# EAGLE design Wifi AC Dimmer V1.1 (EAGLE 6.1)

## Sheet 1 of 2
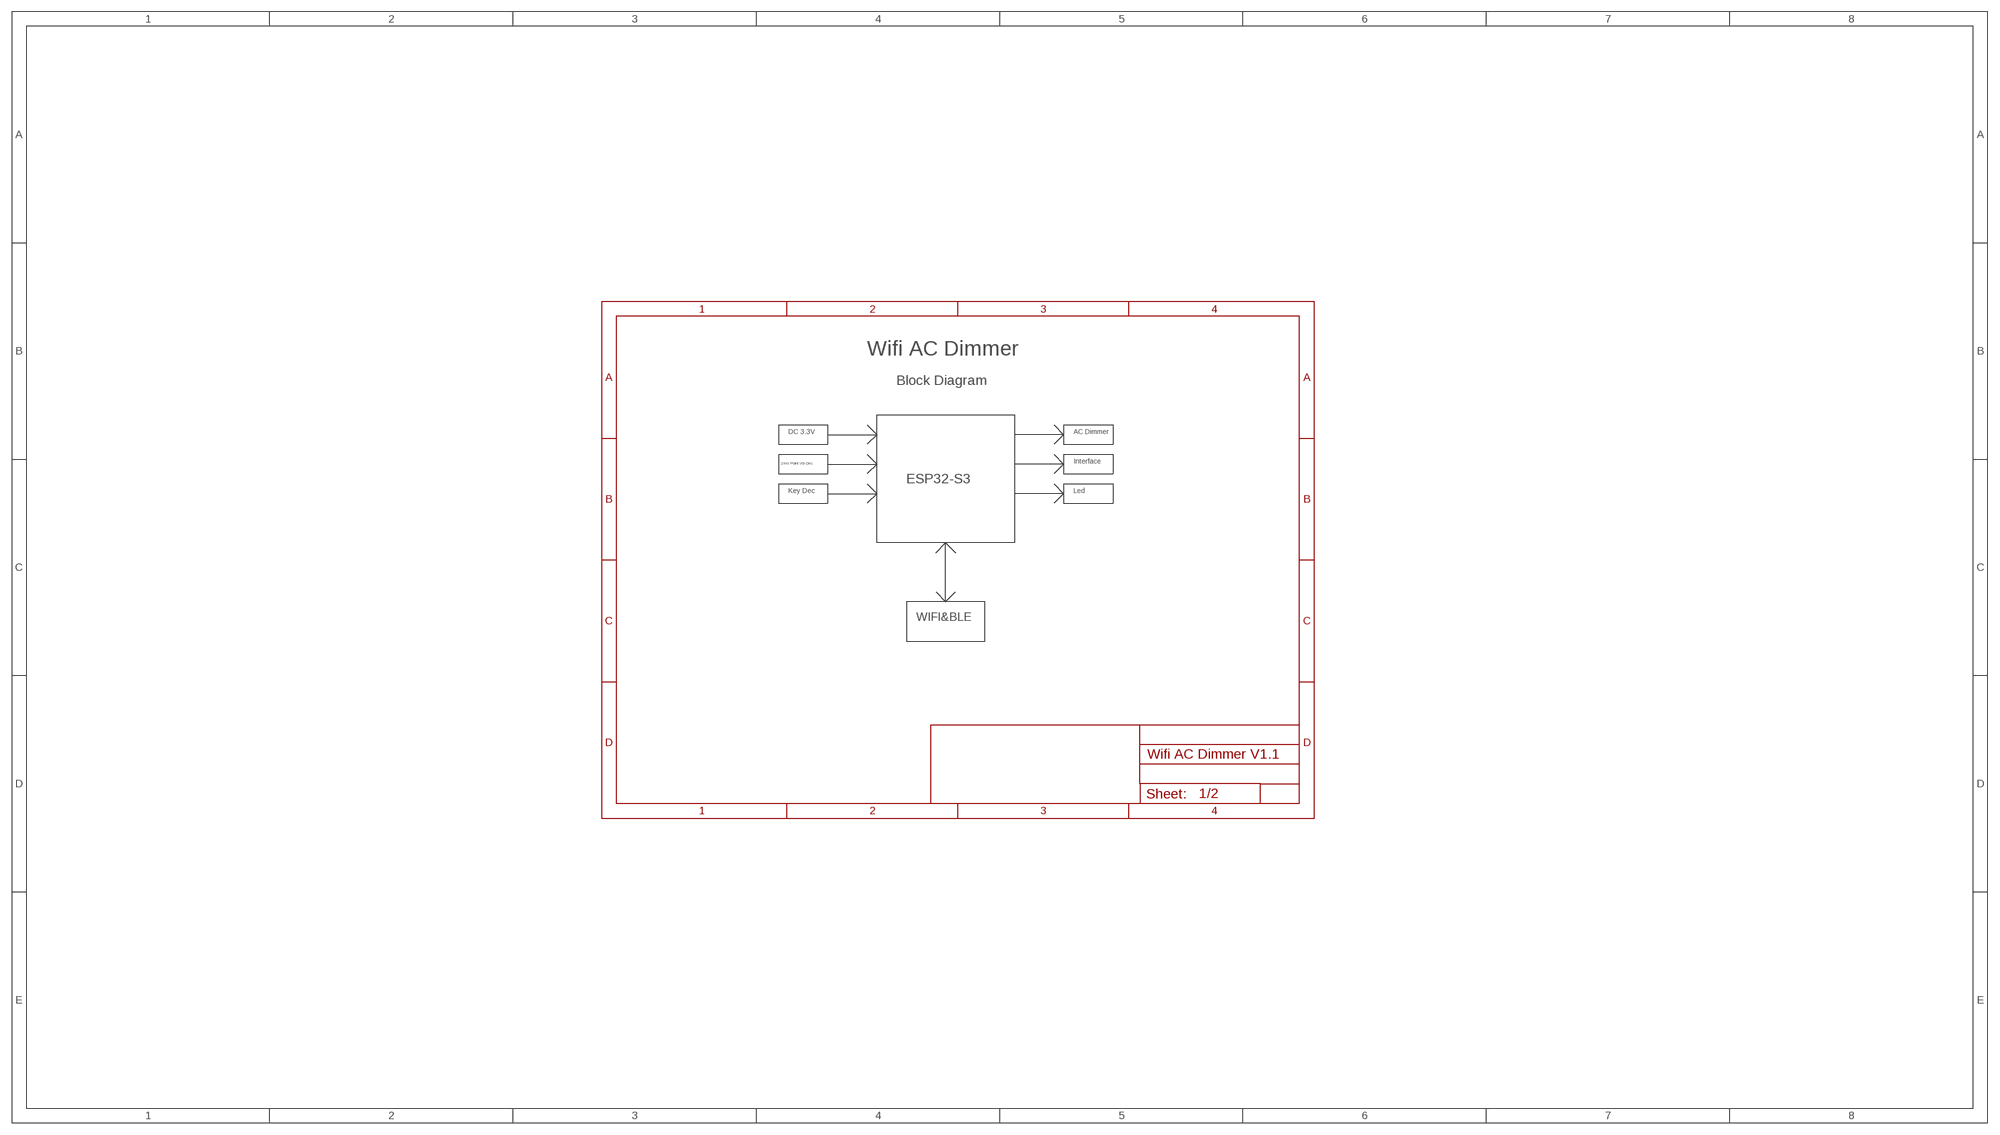
[diagram p0: schematic, sheet 1]

### Notes on the sheet
- Wifi AC Dimmer
- Block Diagram
- DC 3.3V | AC Dimmer
- Zero Point Vol Dec | Interface
- ESP32-S3
- Key Dec | Led
- WIFI&BLE

## Sheet 2 of 2
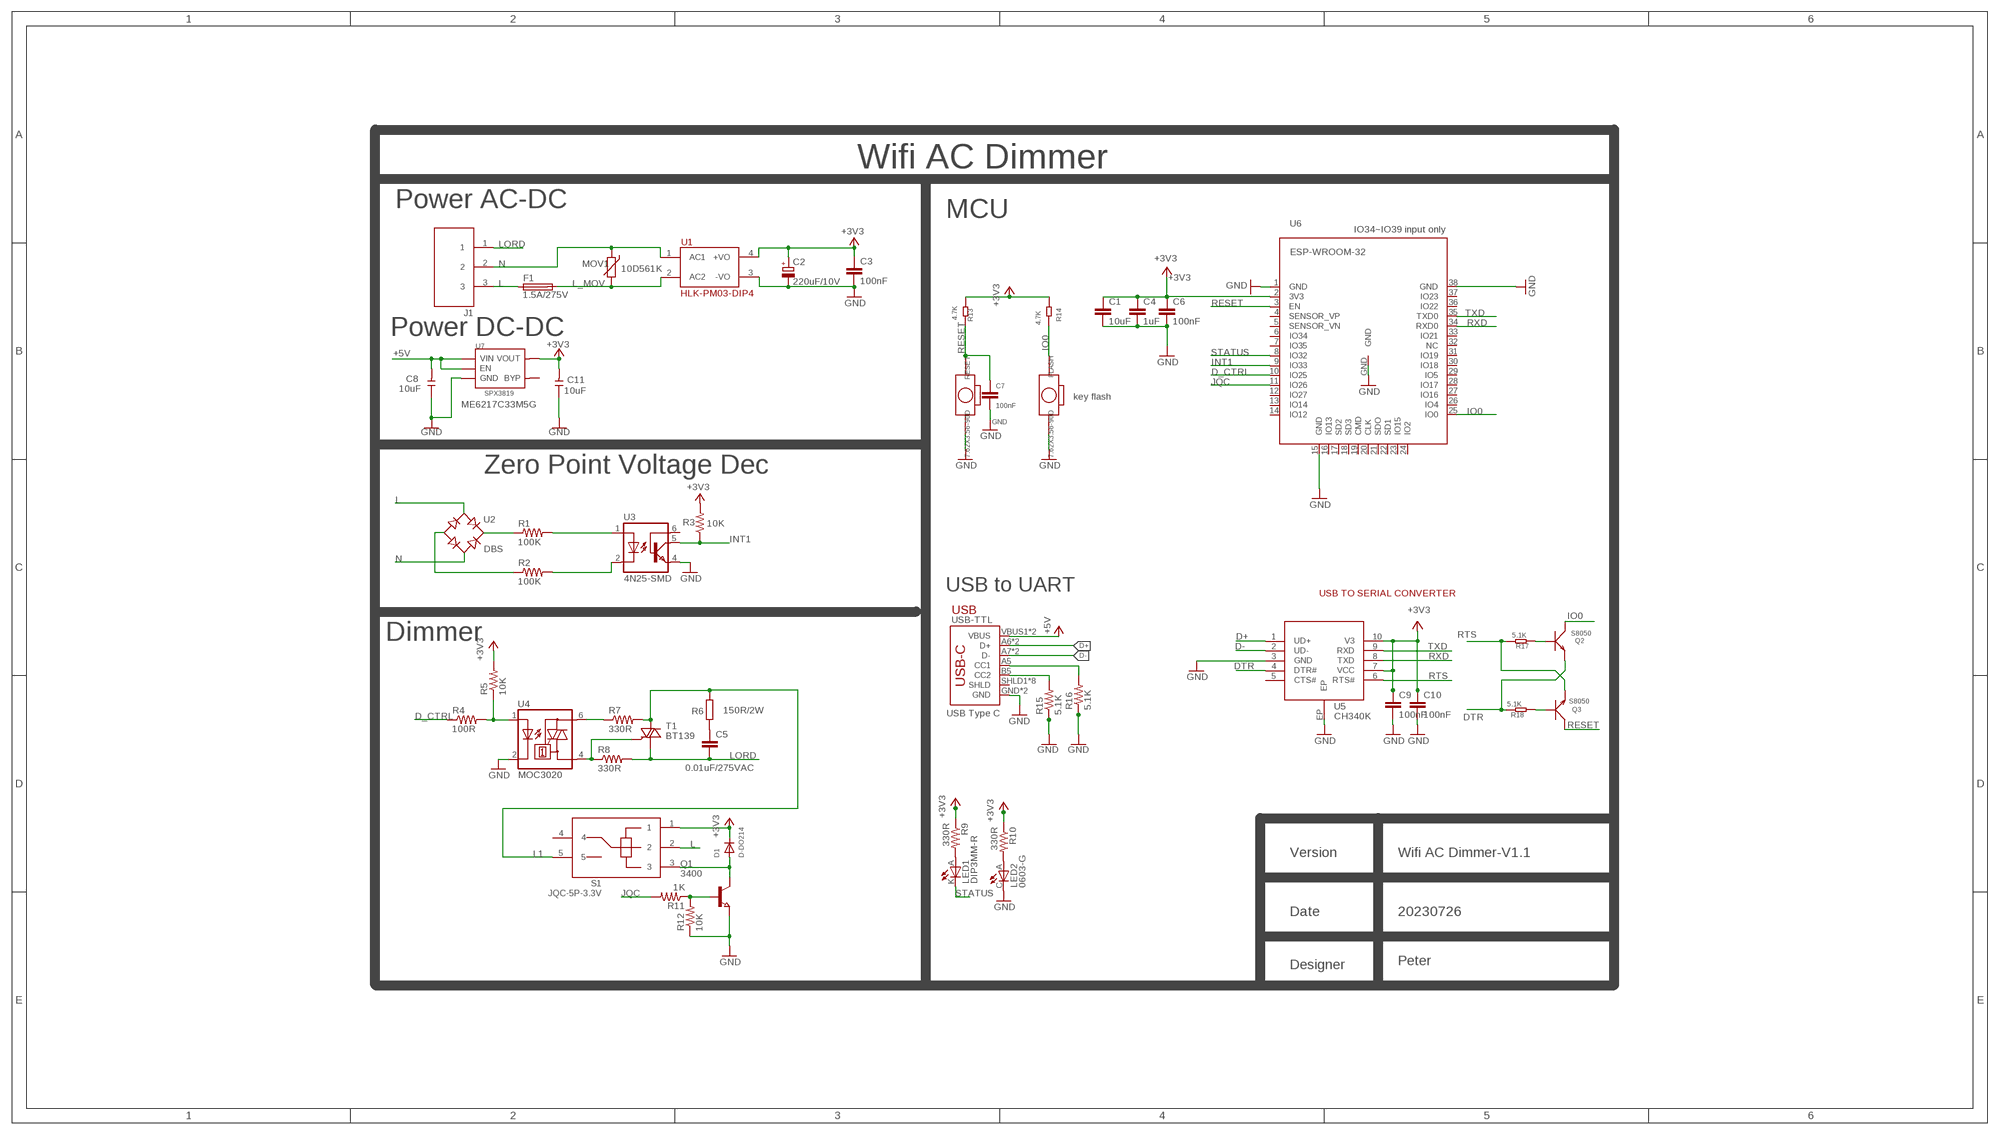
[diagram p1: schematic, sheet 2]

### Parts
C1  10uF  C0603  [C0603]
C2  220uF/10V  C-6.35  [SMD-6.3*5]
C3  100nF  C0603  [C0603]
C4  1uF  C0603  [C0603]
C5  0.01uF/275VAC  XC10B6  [XC10B6]
C6  100nF  C0603  [C0603]
C7  100nF  C0603  [C0603]
C8  10uF  C-0603  [C0603]
C9  100nF  C0603  [C0603]
C10  100nF  C0603  [C0603]
C11  10uF  C-0603  [C0603]
D1  D-DO214  [DO-214]
F1  1.5A/275V  FUSE-DIPFUSE-2P  [PICOFUSE]
FLASH  7.62X3.56-90D  KEY-2P-7.62X3.56-90D  [2P-7.62X3.56-90D]
J1  DBT50G-9.5-3P  [THROUGH-HOLE-9.5]
LED1  DIP3MM-R  LED-3MM  [LED-3MM]
LED2  0603-G  LED0603  [LED0603]
MOV1  10D561K  S10K11  [S10K11]
Q1  3400  NPN-SOT23  [SOT-23]
Q2  S8050  TRANSISTOR-NPN-SOT23  [SOT23]
Q3  S8050  TRANSISTOR-NPN-SOT23  [SOT23]
R1  100K  R0805  [R0805]
R2  100K  R0805  [R0805]
R3  10K  R0603  [R0603]
R4  100R  R0603  [R0603]
R5  10K  R0603  [R0603]
R6  150R/2W  R-0617  [R-0617]
R7  330R  R0805  [R0805]
R8  330R  R0805  [R0805]
R9  330R  R0603  [R0603]
R10  330R  R0603  [R0603]
R11  1K  R0603  [R0603]
R12  10K  R0603  [R0603]
R13  4.7K  R-0603  [R0603]
R14  4.7K  R-0603  [R0603]
R15  5.1K  R0603  [R0603]
R16  5.1K  R0603  [R0603]
R17  5.1K  R-0603  [R0603]
R18  5.1K  R-0603  [R0603]
RESET  7.62X3.56-90D  KEY-2P-7.62X3.56-90D  [2P-7.62X3.56-90D]
S1  JQC-5P-3.3V  [JQC-5P-5V]
T1  BT139  TRIAC-220-TO220  [TO220CL]
U1  HLK-PM03-DIP4  [HLK-PM03]
U2  DBS  [DB-S]
U3  4N25-SMD  [DIL6-SMD]
U4  MOC3020  MOC30  [DIL6-SMD]
U5  CH340K  [ESOP-10-EP-150MIL]
U6  ESP-WROOM-32  [ESP-WROOM-32]
U7  SPX3819  [SOT23-5]
USB-TTL  USB_C5  [USB-C-16P-5]

### Nets
+3V3: C1.1 C2.+ C3.1 C4.1 C6.1 C9.1 C10.1 C11.2 D1.C R3.2 R5.2 R9.1 R10.1 R13.2 R14.2 S1.1 U1.4(+VO) U5.7(VCC) U5.10(V3) U6.2(3V3) U7.5(VOUT)
+5V: C8.2 U7.1(VIN) U7.3(EN) USB-TTL.VBUS1(VBUS) USB-TTL.VBUS2(VBUS)
D+: U5.1(UD+) USB-TTL.A6(D+) USB-TTL.B6(D+)
D-: U5.2(UD-) USB-TTL.A7(D-) USB-TTL.B7(D-)
D_CTRL: R4.1 U6.10(IO25)
DTR: Q2.2(E) R18.1 U5.4(DTR#)
GND: C1.2 C2.- C3.2 C4.2 C6.2 C7.2 C8.1 C9.2 C10.2 C11.1 FLASH.P$2 LED2.C Q1.2(E) R12.1 R15.1 R16.1 RESET.P$2 U1.3(-VO) U3.4(EMI) U4.2(C) U5.3(GND) U5.EP U6.1(GND) U6.15(GND) U6.38(GND) U6.GND U7.2(GND) USB-TTL.GND USB-TTL.GND2(GND)
INT1: R3.1 U3.5(COL) U6.9(IO33)
IO0: FLASH.P$1 Q2.3(C) R14.1 U6.25(IO0)
JQC: R11.2 U6.11(IO26)
L: F1.1 J1.3 S1.2 U2.AC1
L1: R6.2 R7.2 S1.5 T1.A(A2)
L_MOV: F1.2 MOV1.2 U1.2(AC2)
LORD: C5.2 J1.1 R8.2 T1.C(A1)
N: J1.2 MOV1.1 U1.1(AC1) U2.AC2
N$2: Q1.1(B) R11.1 R12.2
N$3: D1.A Q1.3(C) S1.3
N$4: R1.2 U3.1(A)
N$5: R2.1 U2.-
N$6: R2.2 U3.2(C)
N$7: R7.1 U4.6(A2)
N$8: R8.1 T1.G U4.4(A1)
N$9: C5.1 R6.1
N$10: LED1.A R9.2
N$11: R4.2 R5.1 U4.1(A)
N$12: LED2.A R10.2
N$17: Q3.1(B) R18.2
N$18: Q2.1(B) R17.2
N$26: R1.1 U2.+
N$29: R16.2 USB-TTL.A5(CC1)
N$30: R15.2 USB-TTL.B5(CC2)
RESET: C7.1 Q3.3(C) R13.1 RESET.P$1 U6.3(EN)
RTS: Q3.2(E) R17.1 U5.6(RTS#)
RXD: U5.8(TXD) U6.34(RXD0)
STATUS: LED1.K(C) U6.8(IO32)
TXD: U5.9(RXD) U6.35(TXD0)
Unconnected: S1.4 U3.6(BAS) U5.5(CTS#) U6.4(SENSOR_VP) U6.5(SENSOR_VN) U6.6(IO34) U6.7(IO35) U6.12(IO27) U6.13(IO14) U6.14(IO12) U6.16(IO13) U6.17(SD2) U6.18(SD3) U6.19(CMD) U6.20(CLK) U6.21(SDO) U6.22(SD1) U6.23(IO15) U6.24(IO2) U6.26(IO4) U6.27(IO16) U6.28(IO17) U6.29(IO5) U6.30(IO18) U6.31(IO19) U6.32(NC) U6.33(IO21) U6.36(IO22) U6.37(IO23) U7.4(BYP) USB-TTL.SHLD1(SHLD) USB-TTL.SHLD2(SHLD) USB-TTL.SHLD3(SHLD) USB-TTL.SHLD4(SHLD) USB-TTL.SHLD5(SHLD) USB-TTL.SHLD6(SHLD) USB-TTL.SHLD7(SHLD) USB-TTL.SHLD8(SHLD)

### Notes on the sheet
- Wifi AC Dimmer
- Power AC-DC
- MCU
- IO34~IO39 input only
- Power DC-DC
- key flash
- ME6217C33M5G
- Zero Point Voltage Dec
- USB to UART
- USB TO SERIAL CONVERTER
- USB
- Dimmer
- USB Type C
- Version | Wifi AC Dimmer-V1.1
- Date | 20230726
- Peter
- Designer

## Library data of the parts
C1 C3 C4 C6 C7 C9 C10 = Makerfabs-Peter:C0603
C2 = Makerfabs-Peter:C-6.3*5
C5 = Makerfabs-Peter:XC10B6: 13*6 10mm
C8 C11 = Discrete:C*: Ceramic Capacitors
D1 = Makerfabs-Peter:D-DO214
F1 = Makerfabs-Peter:FUSE-DIP
FLASH RESET = Makerfabs-Peter:KEY-2P-7.62X3.56-90D
J1 = self:DBT50G-9.5-3P
LED1 = Makerfabs-Peter:LED-3MM
LED2 = Makerfabs-Peter:LED0603
MOV1 = Makerfabs-Peter:S10K11: 12.5*2*17.5 7.5
Q1 = Makerfabs-Peter:NPN-SOT23
Q2 Q3 = Discrete:TRANSISTOR-NPN*: NPN audion
R1 R2 R7 R8 = Makerfabs-Peter:R0805
R3-R5 R9-R12 R15 R16 = Makerfabs-Peter:R0603
R6 = Makerfabs-Peter:R-0617
R13 R14 R17 R18 = Discrete:R*
S1 = Makerfabs-Peter:JQC-5P-3.3V
T1 = Makerfabs-Peter:TRIAC-220
U1 = Makerfabs-Peter:HLK-PM03
U2 = Makerfabs-Peter:DBS
U3 = Makerfabs-Peter:4N25-SMD
U4 = Makerfabs-Peter:MOC30*
U5 = sale:CH340K
U6 = esp32:ESP-WROOM-32
U7 = IC:SPX3819
USB-TTL = USBC:USB_C: USB Type C 16Pin Connector Super Speed pins not available on the 16-pin purely SMD connector so this part is best for USB 2.0 implementations. D1 and D2 are tied together enabling D+/- no matter which way the cable is plugged into the connector. The two channel configuration pins (CC1/2) are exposed. These are normally connected to ground via 5.1k resistors but can be reconfigured for high current/high power applications.

## Net classes
0 default: width 0.203 mm

## Board
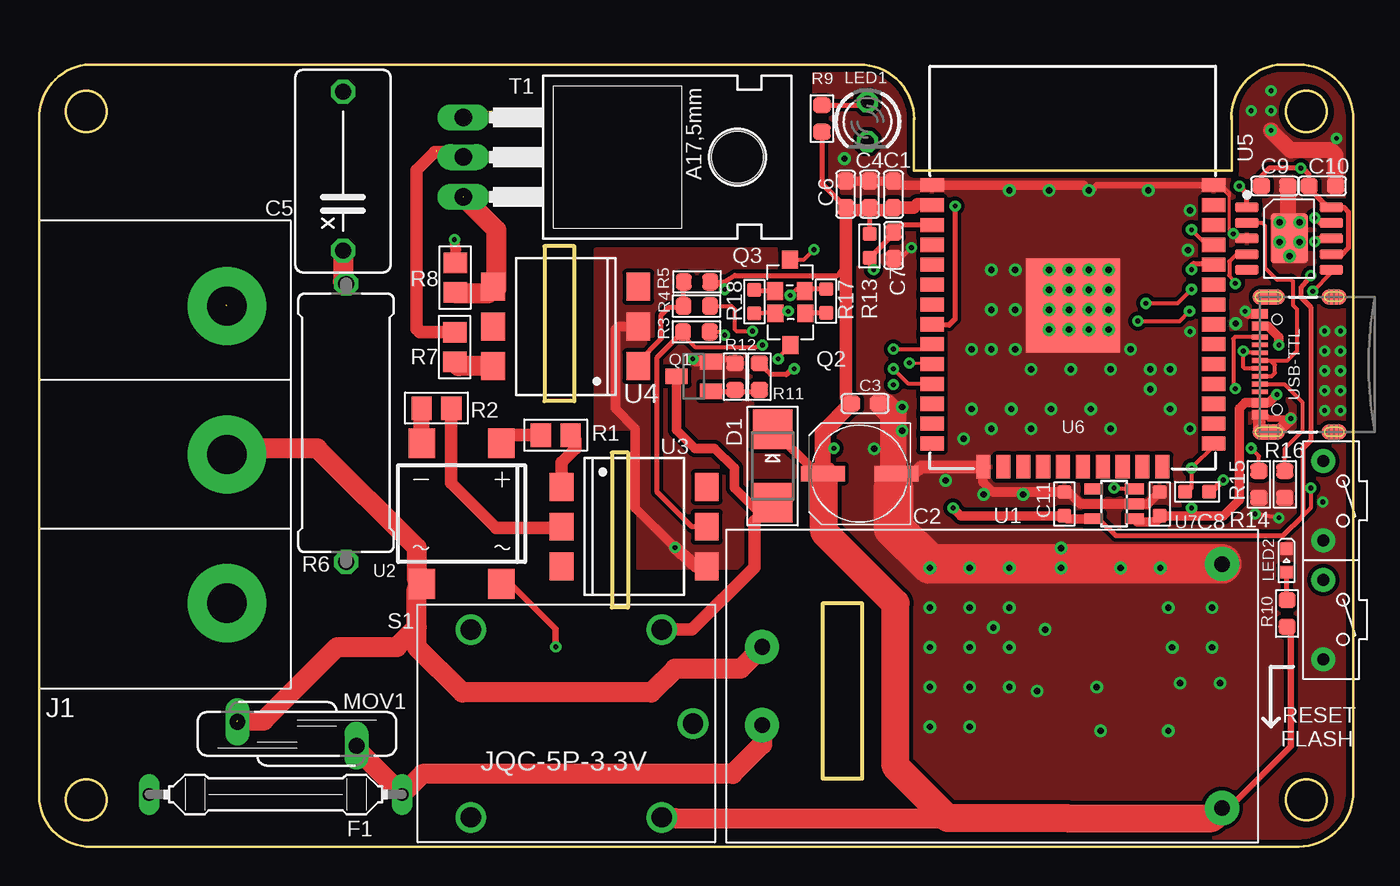
[diagram p2: board, top side]
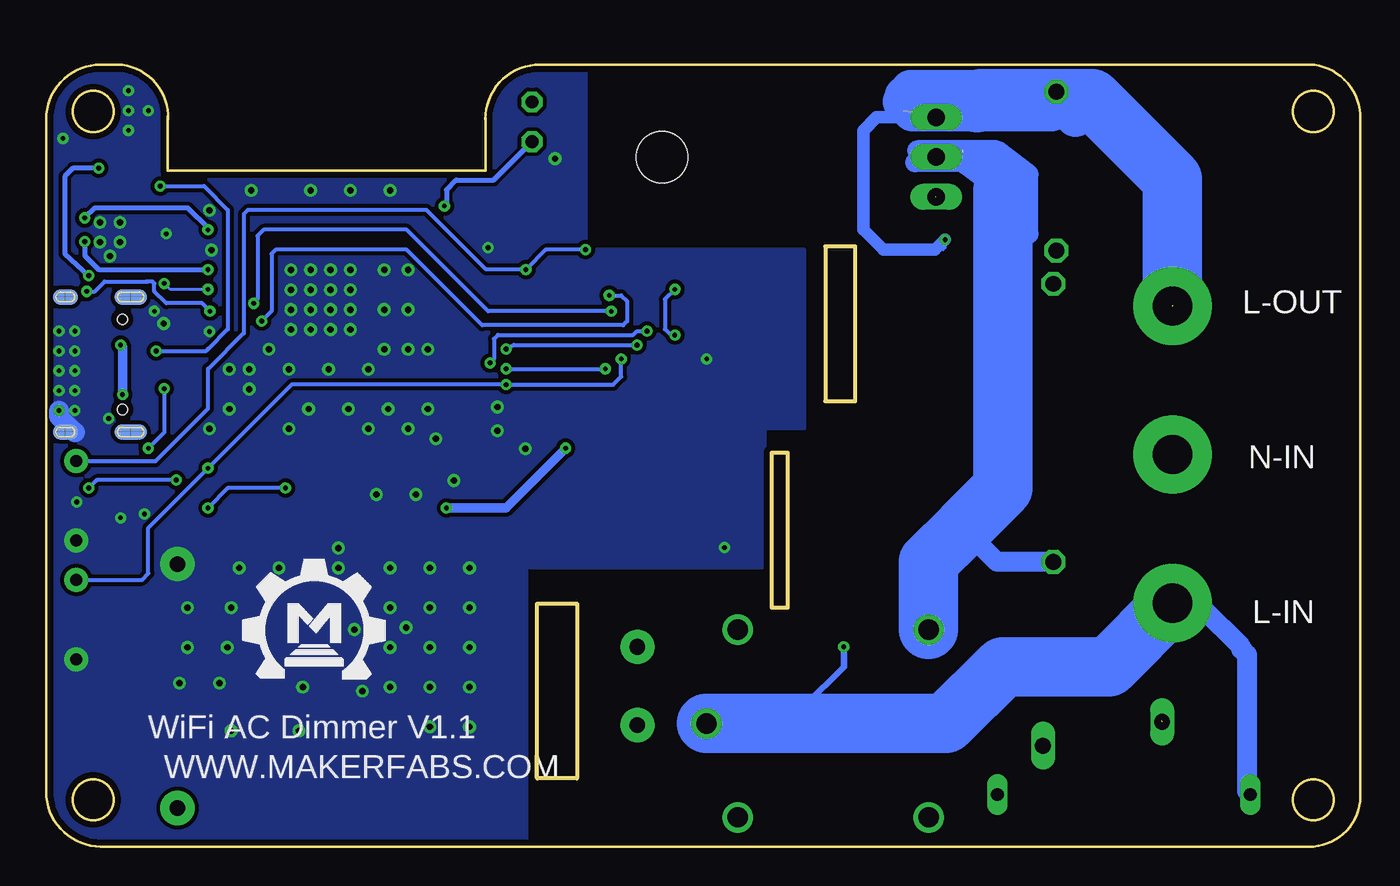
[diagram p3: board, bottom side, seen from below]

Size 84.01 x 50 mm. Coordinates in mm from the lower left corner, seen from the top.
Outline: 55.93,46.57 55.93,43.22
Outline: 55.99,43.22 76.24,43.22
Outline: 76.25,46.7 76.25,43.22
Outline: 55.94,46.5 arc90 52.44,50 3.26,50 arc90 0.01,46.5 0.01,3.5 arc90 3,0 80.51,0 arc90 84.01,3.5 84.01,46.5 arc90 80.51,50 79.46,50 arc90 76.21,46.5
Outline: 50.08,15.53 50.08,4.35 52.62,4.35 52.62,15.53 50.08,15.53
Outline: 34.21,38.39 32.3,38.39 32.3,28.48 34.21,28.48 34.21,38.39
Outline: 36.62,25.18 36.62,15.28 37.64,15.28 37.64,25.18 36.62,25.18
Outline: circle at 3.01,47 radius 1.3
Outline: circle at 3.01,3 radius 1.3
Outline: circle at 81.01,47 radius 1.3
Outline: circle at 81.01,3 radius 1.3
Copper layers (1*16): Top 0.035mm / dielectric 1.5mm / Bottom 0.035mm
Design rules: minimum track width 8mil, minimum drill 12mil, track to track 8mil, track to pad 8mil, pad to pad 8mil, via to via 8mil, smd to smd 0mil, copper to edge 15mil, drill to drill 8mil, minimum pad ring 10mil, minimum via ring 8mil, stop-mask expansion 0mil, vias tented up to drill 0mil, thermal gap 0mil

### Footprints (pad centres in the part's own frame; a part is rotated, then mirrored left to right if it is on the bottom)
C0603 = smd 1.1 x 1: 1 -0.85,0; 2 0.85,0
SMD-6.3*5 = smd 2.8 x 1: + 2.35,0; - -2.35,0
XC10B6 = drill 1.016 octagon: 1 -5.08,0; 2 5.08,0
C0603' = smd 0.889 x 0.889: 1 -0.762,0; 2 0.762,0
DO-214 = smd 2.54 x 2.54: A 2.349,0; C -2.349,0
PICOFUSE = drill 0.813 long: 1 -5.08,0; 2 11.08,0
2P-7.62X3.56-90D = drill 0.762 pad 1.524: P$1 -2.54,0; P$2 2.54,0
THROUGH-HOLE-9.5 = drill 2.5 pad 5: 1 -9.5,0; 2 0,0; 3 9.5,0
LED-3MM = drill 0.813 octagon: A -1.27,0; K 1.27,0
LED0603 = smd 0.8 x 0.8: A -0.75,0; C 0.75,0
S10K11 = drill 1.016 long: 1 -0.762,-3.81; 2 0.762,3.81
SOT-23 = smd 1 x 1.4: 1 -0.95,-1.1; 2 0.95,-1.1; 3 0,1.1
SOT23 = smd 1.016 x 1.143: 1 -0.95,-1.016; 2 0.95,-1.016; 3 0,1.016
R0805 = smd 1.3 x 1.5: 1 -0.95,0; 2 0.95,0
R0603 = smd 1 x 1.1: 1 -0.85,0; 2 0.85,0
R-0617 = drill 1.016 octagon: 1 -8.89,0; 2 8.89,0
R0603' = smd 0.889 x 0.889: 1 -0.762,0; 2 0.762,0
JQC-5P-5V = drill 1.3: 1 -6.35,5.65; 2 -8.35,-0.35; 3 -6.35,-6.35; 4 5.85,5.65; 5 5.85,-6.35
TO220CL = drill 1.118 long: A 0,-11.43; C -2.54,-11.43; G 2.54,-11.43 | hole 3.302: 0,6.096
HLK-PM03 = drill 1 pad 2.184: 1 -14.7,2.5; 2 -14.7,-2.5; 3 14.7,7.8; 4 14.7,-7.8
DB-S = smd 1.7 x 1.9: + -2.55,-4.5; - 2.55,-4.5; AC1 -2.55,4.5; AC2 2.55,4.5
DIL6-SMD = smd 1.78 x 1.52: 1 -2.54,-4.645; 2 0,-4.645; 3 2.54,-4.645; 4 2.54,4.645; 5 0,4.645; 6 -2.54,4.645
ESOP-10-EP-150MIL = smd 1.5 x 0.6: 1 -2.7,2; 2 -2.7,1; 3 -2.7,0; 4 -2.7,-1; 5 -2.7,-2; 6 2.7,-2; 7 2.7,-1; 8 2.7,0; 9 2.7,1; 10 2.7,2 | smd 2.4 x 3.2: EP 0,0
ESP-WROOM-32 = smd 0.9 x 1.5: 1 7.7,9; 2 6.43,9; 3 5.16,9; 4 3.89,9; 5 2.62,9; 6 1.35,9; 7 0.08,9; 8 -1.19,9; 9 -2.46,9; 10 -3.73,9; 11 -5,9; 12 -6.27,9; 13 -7.54,9; 14 -8.81,9; 25 -8.81,-9; 26 -7.54,-9; 27 -6.27,-9; 28 -5,-9; 29 -3.73,-9; 30 -2.46,-9; 31 -1.19,-9; 32 0.08,-9; 33 1.35,-9; 34 2.62,-9; 35 3.89,-9; 36 5.16,-9; 37 6.43,-9; 38 7.7,-9 | smd 1.5 x 0.9: 15 -10.3,5.715; 16 -10.3,4.445; 17 -10.3,3.175; 18 -10.3,1.905; 19 -10.3,0.635; 20 -10.3,-0.635; 21 -10.3,-1.905; 22 -10.3,-3.175; 23 -10.3,-4.445; 24 -10.3,-5.715 | smd 6 x 6: GND 0,0
SOT23-5 = smd 0.69 x 1.2: 1 -0.95,-1.3; 2 0,-1.3; 3 0.95,-1.3; 4 0.95,1.3; 5 -0.95,1.3
USB-C-16P-5 = smd 0.3 x 1: A5 -1.25,-0.34; A6 -0.25,-0.34; A7 0.25,-0.34; A8 1.25,-0.34; B5 1.75,-0.34; B6 0.75,-0.34; B7 -0.75,-0.34; B8 -1.75,-0.34 | smd 0.6 x 1: GND -3.225,-0.34; GND2 3.225,-0.34; VBUS1 -2.45,-0.34; VBUS2 2.45,-0.34 | smd 1 x 2.1: SHLD1 -4.32,-0.915; SHLD2 4.32,-0.915 | smd 1 x 2.1 bottom: SHLD3 -4.32,-0.915; SHLD4 4.32,-0.915 | smd 1 x 1.6: SHLD5 -4.32,-5.095; SHLD8 4.32,-5.095 | smd 1 x 1.6 bottom: SHLD6 -4.32,-5.095; SHLD7 4.32,-5.095 | hole 0.65: -2.89,-1.445; 2.89,-1.445

### Placement (x,y rotation side)
C1  54.61,41.7 90 top
C2  52.45,23.84 180 top
C3  52.79,28.33 0 top
C4  53.09,41.7 90 top
C5  19.42,43.18 90 top
C6  51.56,41.7 90 top
C7  54.62,38.44 270 top
C8  10uF  [C0603']  71.64,21.91 270 top
C9  78.98,42.23 0 top
C10  82.03,42.23 0 top
C11  10uF  [C0603']  65.54,21.91 270 top
D1  46.89,24.33 270 top
F1  12.12,3.33 0 top
FLASH  82.09,14.51 270 top
J1  12.01,25.06 270 top
LED1  52.95,46.34 270 top
LED2  79.74,18.29 90 top
MOV1  16.49,7.21 270 top
Q1  41.85,30.06 90 top
Q2  48.03,33.08 180 top
Q3  47.99,36.52 0 top
R1  33.02,26.31 0 top
R2  25.4,28.04 0 top
R3  42.01,32.91 0 top
R4  42.04,34.56 180 top
R5  42.06,36.1 0 top
R6  19.62,27.09 270 top
R7  26.56,31.93 90 top
R8  26.59,36.38 90 top
R9  50.04,46.55 90 top
R10  79.77,14.9 90 top
R11  46.04,30.05 90 top
R12  44.49,30.05 270 top
R13  4.7K  [R0603']  53.09,38.4 90 top
R14  4.7K  [R0603']  74.03,22.68 0 top
R15  77.98,23.16 90 top
R16  79.63,23.16 90 top
R17  4.7K  [R0603']  50.31,34.88 270 top
R18  4.7K  [R0603']  45.72,34.84 90 top
RESET  82.09,22.11 270 top
S1  33.45,7.52 180 top
T1  38.55,44.08 270 top
U1  60.91,10.26 0 top
U2  27.01,21.29 180 top
U3  38.04,20.45 270 top
U4  33.66,33.25 90 top
U5  79.9,38.88 0 top
U6  66.09,34.58 90 top
U7  68.71,21.91 90 top
U$6  [MAKERFABS_0.3]  70.99,10.76 0 bottom
USB-TTL  77.69,30.83 90 top

### Tracks (layer width: path | path; a pad name or v marks a point on that pad's centre or on a via)
+3V3  (via drill 0.3)
  Top 0.203: U6.2 54.92,41.01 54.62,40.7 | C6.1 51.93,40.85 52.08,40.7
  Top 0.254: R3.2 43.61,32.91 v43.82,32.7 | R5.2 43.34,36.1 v43.82,35.62 | v81.29,22.92 81.29,21.65 80.78,21.15
  Top 0.305: R13.2 C4.1 52.94,40.7 52.08,40.7 | R5.2 43.79,36.1 44.46,36.51 51.06,36.51 51.56,37.27 | R9.1 50.04,42.38 C6.1 | C9.1 78.11,42.25 78.11,42.86 78.62,43.37 v80.65,43.37 80.78,43.37 81.18,42.97 C10.1 81.29,42.13 81.29,41.97 82.39,40.88 U5.10 83.4,40.88 83.7,40.58 83.7,38.29 83.19,37.78 82.7,37.78 U5.7 | R10.1 79.36,14.05 | 67.76,20.96 68.84,19.88 79.51,19.88 80.78,21.15 80.78,25.46 81.29,25.97 81.29,34.48 80.65,35.12 80.65,35.75 v81.29,36.51
  Top 0.406: U1.4 76.07,2.46 80.02,6.41 80.02,13.81 R10.1 | U7.5 67.76,20.96 | R14.2 74.94,22.68 v75.7,23.43
  Top 0.61: C2.+ 49.73,23.84 D1.C | U7.5 65.73,20.96 C11.2 58.94,21.15 v58.43,21.65 | v50.81,25.46 50.1,25.46
  Top 0.813: S1.1 40.66,1.81 | C1.1 55.91,40.85 56.14,41.09 57.01,41.09 U6.2 | 54.62,40.7 52.08,40.7 51.71,40.7 C6.1 51.56,37.27 51.56,28.71 C3.1
  Top 1.016: C2.+ 50.1,25.46 50.1,26.49 C3.1
  Top 1.27: 40.66,1.81 65.7,1.81
  Top 1.778: U1.4 74.96,1.81 65.7,1.81 58.07,1.81 54.74,5.14 54.74,15.56 50.17,20.13 50.17,23.77 C2.+
  Bottom 0.254: v43.82,32.7 44.08,32.7 44.46,33.08 44.46,34.99 v43.82,35.62 | v75.7,23.43 80.78,23.43 v81.29,22.92
  Bottom 0.305: v80.65,43.37 82.3,43.37 82.81,42.86 82.81,37.91 v81.29,36.51
  Bottom 0.61: v58.43,21.65 54.62,21.65 v50.81,25.46
+5V  (via drill 0.3)
  Top 0.254: U7.3 68.78,22.86 v68.71,22.92 | v73.67,21.65 74.18,21.15
  Top 0.305: 70.2,21.15 U7.1
  Top 0.61: U7.1 70.21,20.77 71.38,20.77 71.64,21.02 C8.2 74.18,21.15 75.7,21.15 76.72,22.16 76.72,28 77.1,28.39 78.02,28.39 USB-TTL.VBUS1 78.61,28.38 v79.13,28.89 | USB-TTL.VBUS2 78.56,33.28 79.26,32.58 v79.26,32.07
  Bottom 0.254: v68.71,22.92 72.4,22.92 v73.67,21.65
  Bottom 0.61: v79.13,28.89 79.13,31.94 v79.26,32.07
D+  (via drill 0.3)
  Top 0.254: USB-TTL.B6 77.08,31.58 v76.97,31.69 76.97,30.67 77.06,30.58 USB-TTL.A6
  Top 0.305: U5.1 77.2,41.74 v76.72,42.23
  Bottom 0.254: v76.72,42.23 73.92,42.23 72.4,40.7 72.4,33.08 73.67,31.81 73.79,31.69 v76.97,31.69
D-
  Top 0.254: U5.2 78.18,39.88 78.37,39.69 78.37,37.02 79.13,36.26 80.02,36.26 80.14,36.13 80.14,34.61 80.4,34.35 80.4,31.69 79.76,31.05 78.75,31.05 | 78.75,31.05 78.06,31.05 USB-TTL.A7 | USB-TTL.B7 78.79,30.08 79,30.29 79,30.8 78.75,31.05
D_CTRL  (via drill 0.3)
  Top 0.203: v55.63,30.93 56.78,30.93 57.09,30.62 | U6.10 57.09,30.62 | 57.09,30.62 57.16,30.54
  Top 0.254: R4.1 44.25,34.56 44.46,34.35 44.46,33.08 44.58,32.96 v45.6,32.96
  Bottom 0.254: 45.85,32.96 v45.6,32.96 46.24,32.96 46.49,32.7 55.13,32.7 55.38,32.45 55.38,31.18 v55.63,30.93
DTR  (via drill 0.3)
  Top 0.254: U5.4 76.55,37.88 76.08,37.4 76.08,36.51 v76.46,36.01 | Q2.2 47.75,34.09 v47.89,34.23 | v70.75,34.73 72.78,34.73 v73.67,35.62
  Top 0.305: R18.1 47.07,34.21 Q2.2
  Bottom 0.203: v73.67,35.62 76.08,35.62 v76.46,36.01
  Bottom 0.254: v47.89,34.23 55.76,34.23 60.97,39.43 70.11,39.43 70.49,39.05 70.49,34.99 v70.75,34.73
GND  (via drill 0.3, 0.41)
  Top 0.203: v80.02,27.37 77.99,27.37 | 76.08,41.59 76.08,41.85 75.65,42.28 U6.38 75.09,42.12 75.06,42.1 | v76.33,39.18 76.08,39.43 76.08,41.59 | 76.08,41.59 75.32,42.35 75.19,42.35 75.06,42.23 75.06,42.1 | 75.06,42.1 74.94,41.97
  Top 0.254: R12.1 44.48,30.9 44.46,30.93 | U5.3 76.64,38.88 v76.33,39.18 | v67.1,41.95 67.29,41.95 67.32,41.97 | C7.2 55.06,37.59 v55.76,38.29 | R16.1 79.4,22.31 | v79.26,21.02 v77.73,21.27
  Top 0.406: v41.79,31.18 44.2,31.18 44.46,30.93 | U6.38 67.62,42.28 67.32,41.97 | USB-TTL.GND 78.39,27.6 78.62,27.37 v80.02,27.37
  Top 0.61: U4.2 37.01,33.25 36.84,33.08 36.84,28 38.11,26.73 38.11,21.65 v40.65,19.11 41.92,17.84 | U6.15 60.33,24.24 60.33,23.3 60.97,22.67 C11.1 65.79,22.67 66.56,21.91 U7.2 70.87,21.91 C8.1 | Q1.2 41.96,31.01 v41.79,31.18 | C6.2 C4.2 C1.2 54.88,42.28 U6.1 66.77,42.28 v67.1,41.95 | USB-TTL.GND2 77.27,34.05 77.22,34.1
  Top 0.813: U3.4 41.98,17.91 v40.65,19.11 | U6.15 56.35,24.28 55.89,23.81 54.83,23.81 C2.- | v80.02,27.37 79.13,26.48 78.24,26.48 77.99,26.73 77.99,27.37
  Top 1.016: C9.2 79.83,39.62 80.02,39.43 | C10.2 82.88,44.19 82.56,44.51 80.02,44.51 v78.75,45.78
  Top 1.676: 54.62,22.92 54.62,27.62 54.11,28.13
  Top 2.54: U1.3 56.94,18.06 54.62,20.38 54.62,22.92
  Bottom 1.27: v83.19,27.88 83.19,27.5 82.18,26.48
  other vias: 72.94,10.45 74.98,15.28 72.18,7.4 75.48,10.45 67.61,10.2 67.86,7.4 71.67,17.82 62.02,17.82 64.31,13.88 61.01,14.01 63.8,9.94 64.56,36.87 65.83,36.87 67.1,36.87 68.37,36.87 68.37,35.6 68.37,34.33 68.37,33.06 67.1,33.06 65.83,33.06 64.56,33.06 64.56,34.33 64.56,35.6 65.83,35.6 67.1,35.6 67.1,34.33 65.83,34.33 79.29,39.91 80.56,39.91 80.56,38.64 79.29,38.64 79.93,37.76 70.91,41.95 73.45,38.14 73.58,40.68 73.58,32.93 60.88,36.87 60.88,34.33 60.88,31.79 63.42,30.52 65.96,30.52 68.5,30.52 71.04,30.52 72.31,27.98 67.23,27.98 64.69,27.98 62.15,27.98 59.61,27.98 60.88,26.71 63.42,26.71 59.1,26.07 68.5,26.71 77.1,34.23 82.18,32.96 82.18,30.42 82.18,27.88 82.18,31.69 82.18,29.15 83.19,29.15 83.19,30.42 83.19,31.69 83.19,32.96 82.05,22.04 76.5,33.44 56.94,17.82 56.94,15.28 56.94,12.74 56.94,10.2 56.94,7.66 59.48,7.66 59.48,10.2 59.48,12.74 59.48,15.28 59.48,17.82 62.02,15.28 62.02,12.74 62.02,10.2 72.18,15.28 74.98,12.74 65.32,17.82 65.32,19.09 62.91,22.52 60.37,22.52 57.96,23.4 55.16,26.58 55.16,28.1 53.39,25.44 62.4,31.79 62.4,34.33 62.4,36.87 64.56,41.95 62.02,41.95 78.75,47.05 77.48,47.05 78.75,48.32 51.48,43.98 82.94,45.28 69.77,31.79 71.04,29.25 73.58,26.71 72.31,30.52 59.61,31.79 69.13,17.82 72.44,12.74
  pour Top (isolate 0.254, rank 6): 49.54,55.94 49.54,38.16 35.57,38.16 35.57,28 35.57,26.73 38.11,26.73 38.11,17.84 53.35,17.84 53.35,-2.48 87.64,-2.48 88.91,-2.48 88.91,55.94
  pour Bottom (isolate 0.254, rank 6): 49.54,55.94 49.54,38.16 35.57,38.16 35.57,26.73 38.11,26.73 38.11,17.84 53.35,17.84 53.35,-2.48 91.45,-2.48 92.72,-2.48 92.72,59.75 49.54,59.75
INT1  (via drill 0.3)
  Top 0.254: R3.1 41.16,32.7 41.92,31.94 45.85,31.94 v46.24,32.07 | v54.62,31.81 57.16,31.81 57.16,32.05 U6.9
  Top 0.305: U3.5 41.73,20.45 39.5,22.67 39.5,31.26 R3.1
  Bottom 0.254: v54.62,31.81 54.11,32.07 v46.24,32.07
IO0  (via drill 0.3)
  Top 0.254: U6.25 75.09,25.61 v73.67,24.19 73.67,22.92 73.42,22.68 R14.1 | v47.25,31.18 47.25,31.28 Q2.3
  Bottom 0.254: FLASH.P$1 77.89,17.05 77.48,17.46 77.48,20.38 v73.67,24.19 68.33,29.53 v54.62,29.53 47.76,29.53 47.25,30.04 v47.25,31.18
JQC  (via drill 0.3)
  Top 0.254: U6.11 55.58,29.58 v54.62,30.54 | 46.4,30.54 R11.2
  Top 0.305: v48.27,30.54 48.14,30.54 47.76,30.16 46.78,30.16 46.4,30.54
  Bottom 0.254: v54.62,30.54 v48.27,30.54
L  (via drill 0.3)
  Top 0.406: U2.AC1 30.14,16.79 33.03,13.91 v33.03,12.76
  Bottom 0.203: 35.57,8.95 40.71,8.95 S1.2
  Bottom 0.406: v33.03,12.76 33.03,11.49 35.57,8.95
  Bottom 1.27: 16.08,11.49 15.25,11.49 11.44,15.3 10.17,15.3 7.63,12.76 7.63,12.64 7.25,12.26 7.25,3.54 F1.1
  Bottom 3.81: S1.2 26.49,7.87 22.87,11.49 16.08,11.49 J1.3
L1  (1 unrouted)
  Top 0.203: 25.28,44.39 25.41,44.51 26.68,44.51 26.68,43.75
  Top 0.813: R7.2 24.34,32.88 24.14,33.08 24.14,43.24 25.28,44.39 26.81,44.39 T1.A
  Bottom 0.203: 24.65,43.75 24.65,44.01 24.26,44.39 | 24.39,44.39 24.26,44.39 | 24.26,44.39 24.14,44.51 | 25.28,43.62 25.41,43.75 25.41,44.39
  Bottom 1.27: R6.2 23.22,18.2 25.41,20.38 | 22.87,41.97 22.87,43.24 24.39,44.39 25.41,44.39 28.2,44.39 | 24.65,43.75 25.41,43.75 28.46,43.75 | 23.76,42.48 25.28,43.62 | 28.33,44.51 24.14,44.51 23.25,44.51 21.22,42.99 21.22,39.18
  Bottom 3.81: 22.81,40.78 22.87,41.97 22.87,22.92 25.41,20.38 27.6,18.19 S1.5
L_MOV
  Top 1.27: MOV1.2 20.3,6.24 F1.2 24.51,4.64 44.33,4.64 46.21,6.52 U1.2 46.21,8.21
LORD  (via drill 0.3)  (2 unrouted)
  Top 0.61: R8.2 26.59,38.76 v26.55,38.8 26.55,38.29 26.68,38.16
  Bottom 0.203: 21.6,47.82 21.15,48.26 C5.2 19.74,48.26 19.87,48.4 | 17.79,47.82 17.79,47.05 | v26.55,38.8 26.55,38.29 26.68,38.16 | 28.77,48.4 29.15,48.4 29.22,48.32 29.16,48.26 29.16,48.02 29.16,47.7 29.22,47.63 29.22,47.05 | 28.65,47 28.33,47 27.95,46.62
  Bottom 0.813: T1.C 27.95,46.62 30.92,46.62 31.76,45.78 31.76,39.43 30.49,38.16 27.19,38.16 v26.55,38.8
  Bottom 2.54: 18.22,46.62 17.79,47.05 | 28.77,48.4 19.87,48.4 | 29.16,48.02 20.26,48.02 | 29.28,47.63 29.22,47.63 20.38,47.63 | 28.65,47 19.75,47
  Bottom 3.81: 24.52,47.56 24.26,47.82 21.6,47.82 17.79,47.82 17.15,47.82 12.01,42.67 12.01,34.67 11.95,34.61
N  (1 unrouted)
  Top 0.203: 12.41,25.46 J1.2
  Top 1.27: U1.1 46.21,12.74 44.84,11.37 40.65,11.37 39.12,9.84 27.06,9.84 24.14,12.76 24.14,14.03 | 24.14,14.03 24.14,16.47 U2.AC2 24.14,17.11 24.14,19.11 17.79,25.46 12.41,25.46 | 12.71,8.06 14.36,8.06 19.06,12.76 22.87,12.76 24.14,14.03
N$2
  Top 0.305: Q1.1 44.46,29.11 | 44.46,29.11 45.95,29.11 R11.1 | R12.2 44.49,29.14 44.46,29.11
N$3
  Top 0.203: D1.A 46.89,21.76 | 46.89,21.76 47,21.65 | 46.89,21.76 45.73,22.92
  Top 0.61: 46.15,21.23 44.46,22.92 44.46,24.19 43.19,25.46 41.92,25.46 40.75,26.63 Q1.3
  Top 0.813: S1.3 41.75,13.87 45.73,17.84 45.73,20.82 46.15,21.23 D1.A
N$4
  Top 0.813: U3.1 33.39,24.56 34.3,25.46 34.3,25.98 R1.2
N$5
  Top 1.016: U2.- R2.1
N$6
  Top 0.813: R2.2 26.35,23.25 29.22,20.38 33.33,20.38 U3.2
N$7
  Top 1.27: U4.6 26.83,30.71 R7.1
N$8  (1 unrouted)
  Top 0.203: R8.1 28.65,35.43 U4.4
  Top 1.27: T1.G 29.22,39.43 29.22,35.62 28.96,35.62 28.71,35.37 26.65,35.37 R8.1
N$9
  Top 0.203: R6.1 19.59,35.98 19.57,36.01
  Top 1.27: C5.1 19.42,36.15 19.57,36.01
N$10
  Top 0.305: R9.2 52.55,47.4 52.84,47.69 52.92,47.61 LED1.A
N$11
  Top 0.305: U4.1 38.3,30.99 39.76,32.45 39.76,33.97 40.27,34.48 41.1,34.48 R4.2 41.19,36.08 R5.1
N$12
  Top 0.305: R10.2 79.77,17.45 79.76,17.46 79.76,17.52 LED2.A
N$17
  Top 0.305: Q3.1 45.95,35.5 R18.2
N$18
  Top 0.305: R17.2 49.08,34.12 Q2.1
N$26
  Top 0.813: R1.1 30.07,26.31 U2.+
N$29
  Top 0.254: USB-TTL.A5 78.08,29.53 79.64,29.53 80.78,28.39 80.78,26.61 79.63,25.46 R16.2
N$30  (via drill 0.3)
  Top 0.254: USB-TTL.B5 76.46,32.58 76.33,32.45 76.33,29.4 v76.46,29.27 | R15.2 77.98,24.96 v77.48,25.46
  Bottom 0.254: v77.48,25.46 77.1,25.84 76.59,26.35 76.46,26.48 v76.46,29.27
RESET  (via drill 0.3)
  Top 0.254: Q3.3 48.91,37.53 v49.54,38.16 | R13.1 53.09,37.15 v53.35,36.89
  Top 0.305: R13.1 54.62,39.17 C7.1 55.08,39.74 U6.3
  Bottom 0.254: v49.54,38.16 52.08,38.16 v53.35,36.89 55.89,36.89 59.7,40.7 71.13,40.7 71.38,40.45 71.38,32.83 73.67,30.54 73.67,28 77.02,24.65 RESET.P$1
RTS  (via drill 0.3)
  Top 0.254: U5.6 82.6,36.69 v81.41,35.5 | R17.1 48.41,35.64 v48.01,35.24 | v70.24,33.59 72.91,33.59 v73.54,34.23
  Top 0.305: R17.1 49.08,35.64 Q3.2
  Bottom 0.254: v48.01,35.24 47.25,35.24 46.87,34.86 46.87,33.59 47.12,33.34 56.14,33.34 60.97,38.16 69.35,38.16 69.6,37.91 69.6,34.23 v70.24,33.59 | v81.41,35.5 80.91,35.5 80.27,36.13 77.6,36.13 77.48,36.13 77.22,36.13 77.1,36.01 77.1,35.5 76.33,34.73 74.05,34.73 v73.54,34.23
RXD  (via drill 0.3)
  Top 0.305: U5.8 81.75,38.88 v81.54,38.67 | v73.67,36.89 73.67,37.15 73.79,37.27 75.01,37.27 U6.34
  Bottom 0.305: v81.54,38.67 81.54,37.78 80.65,36.89 v73.67,36.89
STATUS  (via drill 0.3)
  Top 0.203: 57.16,33.08 57.09,33.16 U6.8 57.14,33.34 57.16,33.34
  Top 0.305: v58.55,40.96 58.55,33.72 58.17,33.34 57.16,33.34
  Bottom 0.305: LED1.K 55.41,42.61 57.79,42.61 58.43,41.97 58.43,41.09 v58.55,40.96
TXD  (via drill 0.3)
  Top 0.254: U6.35 74.63,38.47 v73.67,39.43
  Top 0.305: U5.9 81.86,39.88 v81.54,40.2
  Bottom 0.254: v73.67,39.43 73.67,39.56 74.81,40.7
  Bottom 0.305: v81.54,40.2 80.91,40.83 74.94,40.83 73.67,39.56

### Text on the board
bPlace: L-OUT | N-IN | L-IN | WiFi AC Dimmer V1.1 | WWW.MAKERFABS.COM